# EAGLE design USB (EAGLE 9.4.2)
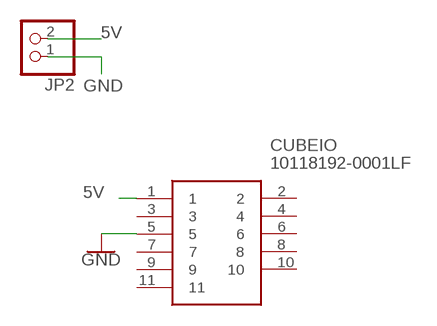
[diagram p0: schematic, sheet 1]

## Parts
CUBEIO  10118192-0001LF  [101181920001LF]
JP2  PINHD-1X2  [1X02]

## Nets
5V: CUBEIO.1 JP2.2
GND: CUBEIO.5 JP2.1
Unconnected: CUBEIO.2 CUBEIO.3 CUBEIO.4 CUBEIO.6 CUBEIO.7 CUBEIO.8 CUBEIO.9 CUBEIO.10 CUBEIO.11

## Library data of the parts
CUBEIO = SamacSys_Parts:10118192-0001LF: USB Connectors 5P MICRO USB TYPE B RECEPTACLE Source: Datasheet <https://www.mouser.tw/datasheet/2/18/10118192-1361887.pdf>; ALLIED_NUMBER: 70236826; ALLIED_PRICE-STOCK: https://www.alliedelec.com/amphenolfci-10118192-0001lf/70236826/; DESCRIPTION: USB Connectors 5P MICRO USB TYPE B RECEPTACLE; HEIGHT: 2.8mm; MANUFACTURER_NAME: FCI / Amphenol; MANUFACTURER_PART_NUMBER: 10118192-0001LF; MOUSER_PART_NUMBER: 649-10118192-0001LF
JP2 = DC_LOAD_AU:PINHD-1X2: PIN HEADER

## Board
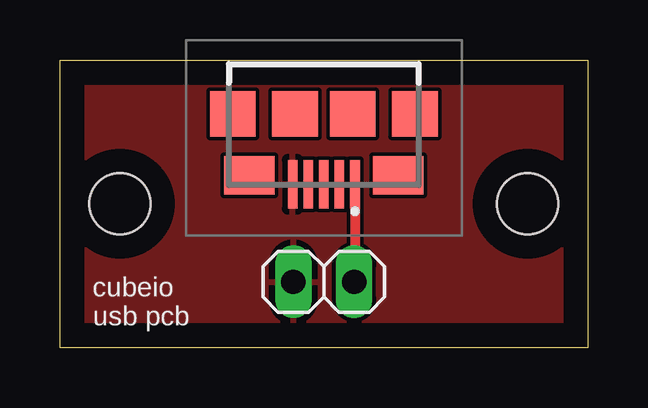
[diagram p1: board, top side]

Size 22 x 12 mm. Coordinates in mm from the lower left corner, seen from the top.
Outline: 0,0 0,12 22,12 22,0 0,0
Copper layers (1*16): Top 0.035mm / dielectric 1.5mm / Bottom 0.035mm
Design rules "default": minimum track width 6mil, minimum drill 0.35mm, track to track 6mil, track to pad 6mil, pad to pad 6mil, via to via 6mil, smd to smd 6mil, copper to edge 40mil, drill to drill 6mil, minimum pad ring 10mil, minimum via ring 8mil, stop-mask expansion 4mil, vias tented up to drill 0mil, thermal gap 10mil
Holes 2.54 mm at 19.5,6 2.5,6

### Footprints (pad centres in the part's own frame; a part is rotated, then mirrored left to right if it is on the bottom)
101181920001LF = smd 0.4 x 2.032: 1 -1.3,1.936; 2 -0.65,1.936; 3 0,1.936; 4 0.65,1.936; 5 1.3,1.936 | smd 2.1 x 1.6: 6 -3.1,1.557; 7 3.1,1.557 | smd 1.9 x 1.9: 8 -1.2,-0.993; 9 1.2,-0.993; 10 -3.8,-0.993; 11 3.8,-0.993
1X02 = drill 1.016 long: 1 -1.27,0; 2 1.27,0

### Placement (x,y rotation side)
CUBEIO  11,8.75 180 top
JP2  11,2.74 0 top

### Tracks (layer width: path | path; a pad name or v marks a point on that pad's centre or on a via)
5V
  Top 0.406: CUBEIO.1 12.3,2.77 JP2.2
GND
  pour Top: 0.13,0.03 0.13,11.41 0.64,11.91 21.26,11.91 21.97,11.21 21.97,0.6 21.43,0.07 0.2,0.07 0.17,0.1

### Text on the board
tNames: cubeio / usb pcb
bNames: Perkins+Will / Cubeio USB / September 2019 / v2.5